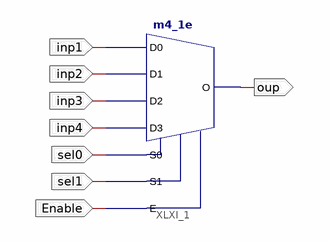
[diagram p0: schematic sheet 1]
// Xilinx ISE schematic mux.sch (xpla3) as structural Verilog: 1 symbols, 8 ports
module mux (
  input  inp1,
  input  inp2,
  input  inp3,
  input  inp4,
  input  sel0,
  input  sel1,
  input  Enable,
  output oup
);

  m4_1e XLXI_1 (.D0(inp1), .D1(inp2), .D2(inp3), .D3(inp4), .E(Enable), .S0(sel0), .S1(sel1), .O(oup));
endmodule
